# EAGLE design ChargePump (EAGLE 9.0.0)
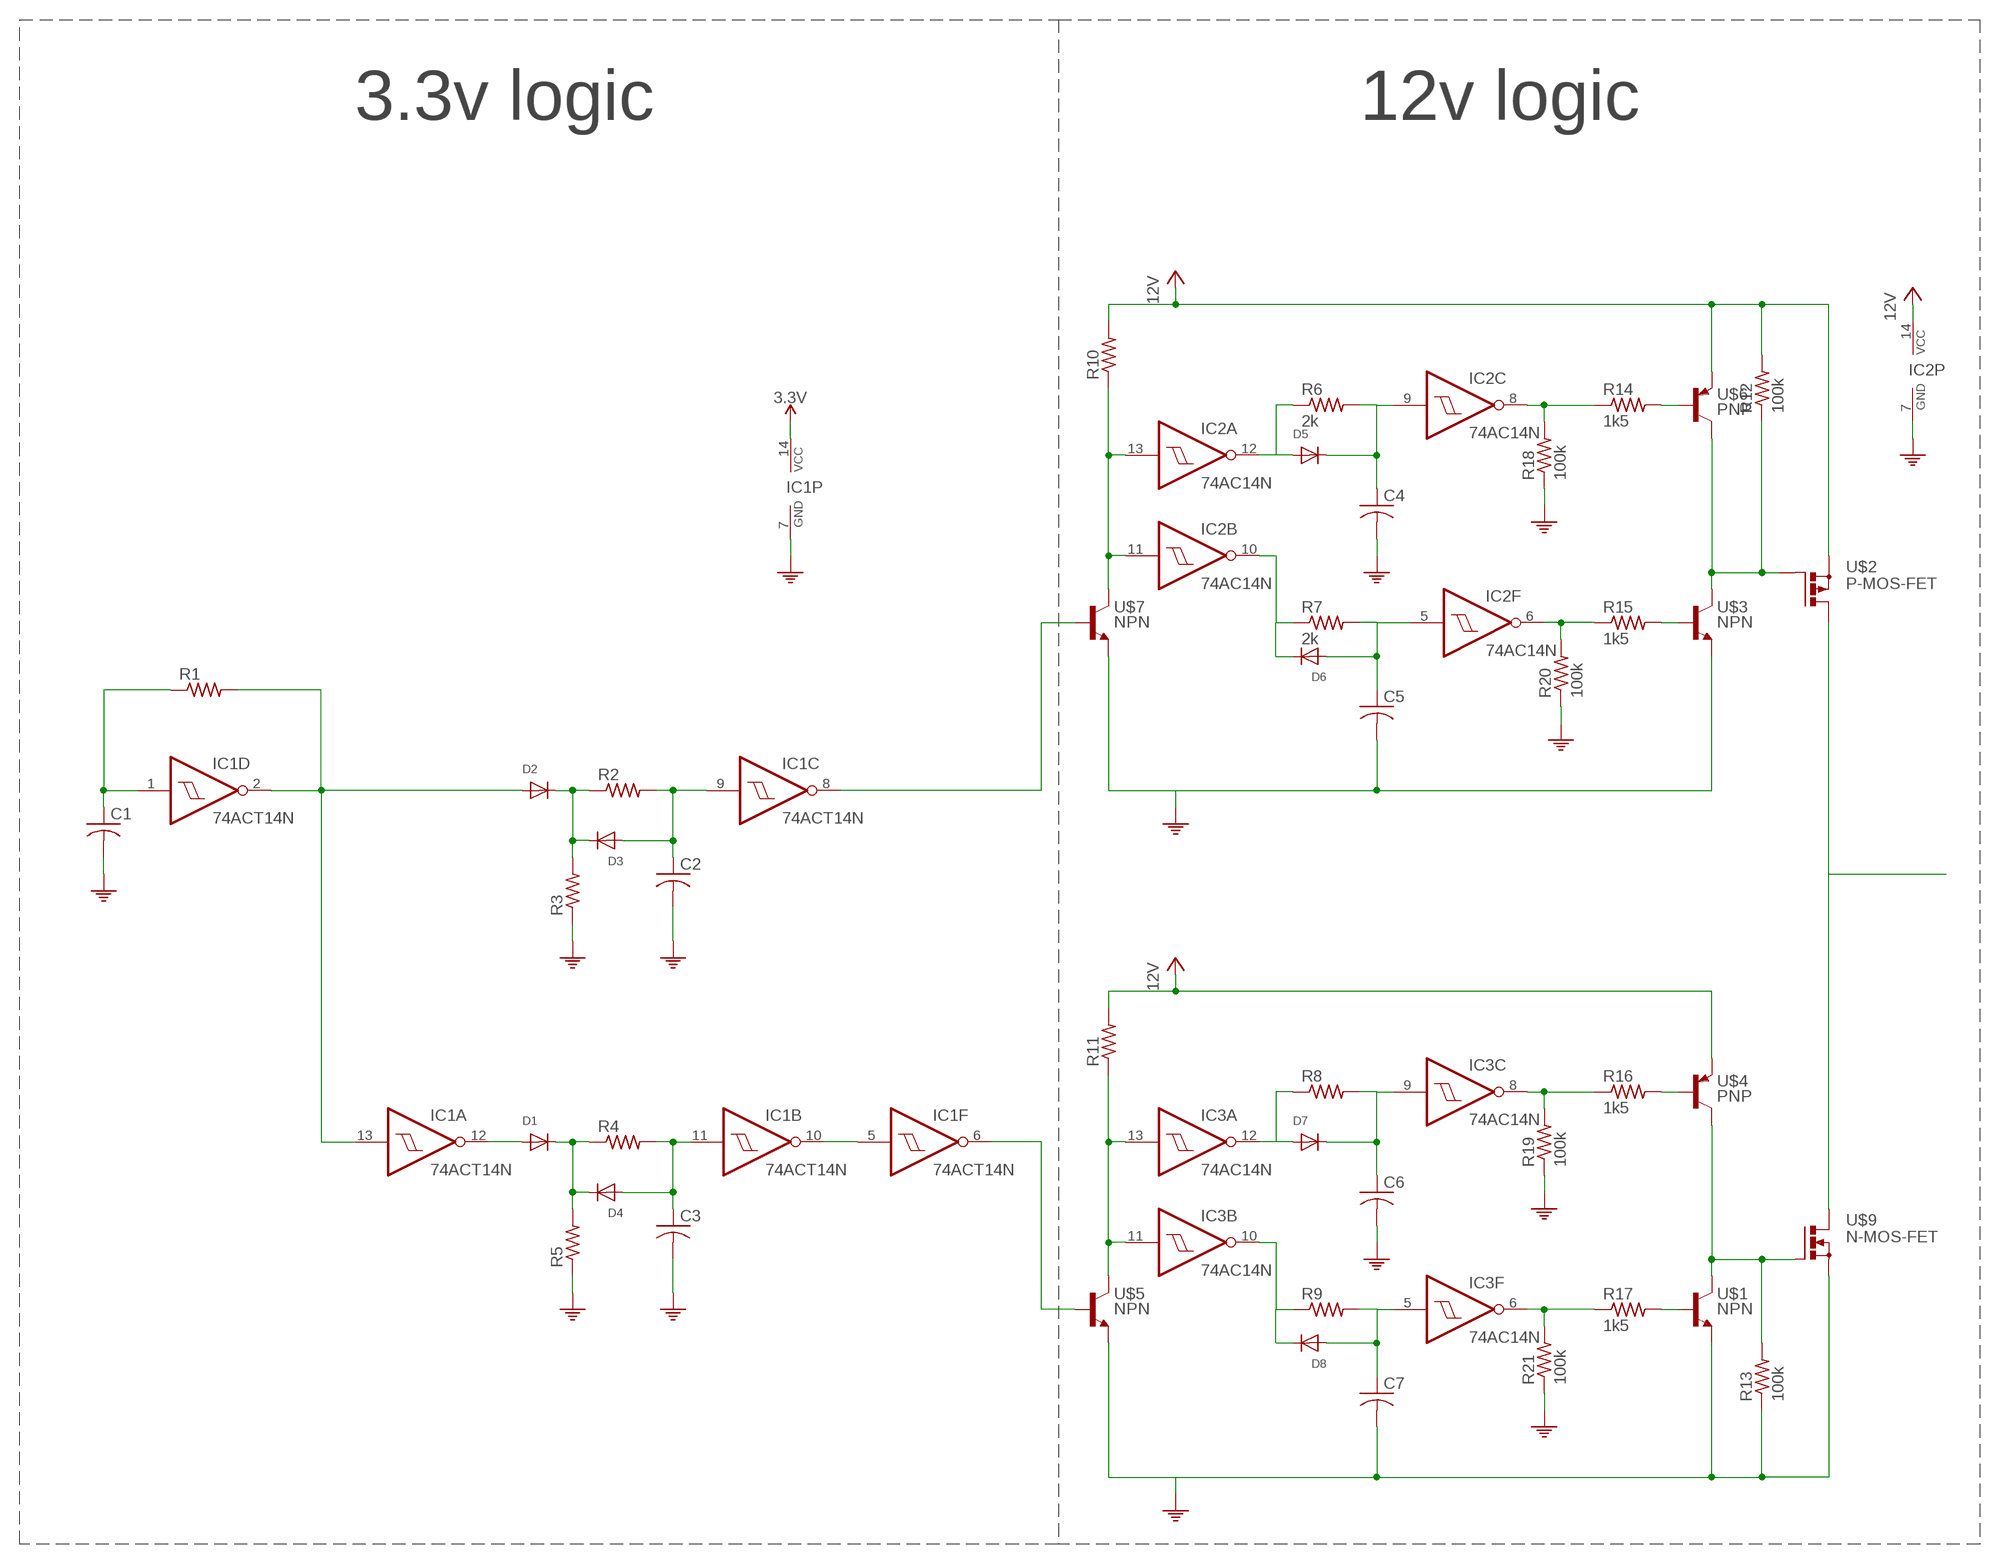
[diagram p0: schematic, sheet 1]

## Parts
C1  C-USC0603  [C0603]
C2  C-USC0603  [C0603]
C3  C-USC0603  [C0603]
C4  C-USC0603  [C0603]
C5  C-USC0603  [C0603]
C6  C-USC0603  [C0603]
C7  C-USC0603  [C0603]
D1  DIODEDO-1N4148  [DO-1N4148]
D2  DIODEDO-1N4148  [DO-1N4148]
D3  DIODEDO-1N4148  [DO-1N4148]
D4  DIODEDO-1N4148  [DO-1N4148]
D5  DIODEDO-1N4148  [DO-1N4148]
D6  DIODEDO-1N4148  [DO-1N4148]
D7  DIODEDO-1N4148  [DO-1N4148]
D8  DIODEDO-1N4148  [DO-1N4148]
IC1  74ACT14N  [DIL14]
IC2  74AC14N  [DIL14]
IC3  74AC14N  [DIL14]
R1  R-US_R0603  [R0603]
R2  R-US_R0603  [R0603]
R3  R-US_R0603  [R0603]
R4  R-US_R0603  [R0603]
R5  R-US_R0603  [R0603]
R6  2k  R-US_R0603  [R0603]
R7  2k  R-US_R0603  [R0603]
R8  R-US_R0603  [R0603]
R9  R-US_R0603  [R0603]
R10  R-US_R0603  [R0603]
R11  R-US_R0603  [R0603]
R12  100k  R-US_R0603  [R0603]
R13  100k  R-US_R0603  [R0603]
R14  1k5  R-US_R0603  [R0603]
R15  1k5  R-US_R0603  [R0603]
R16  1k5  R-US_R0603  [R0603]
R17  1k5  R-US_R0603  [R0603]
R18  100k  R-US_R0603  [R0603]
R19  100k  R-US_R0603  [R0603]
R20  100k  R-US_R0603  [R0603]
R21  100k  R-US_R0603  [R0603]
U$1  NPN  [SOT23]
U$2  P-MOS-FET  [SOT23]
U$3  NPN  [SOT23]
U$4  PNP  [SOT23]
U$5  NPN  [SOT23]
U$6  PNP  [SOT23]
U$7  NPN  [SOT23]
U$9  N-MOS-FET  [SOT23]

## Nets
3.3V: IC1.14(P:VCC)
+12V: IC2.14(P:VCC) R10.2 R11.2 R12.2 U$2.C(S) U$4.E U$6.E ; supply symbol labelled 12V
GND: C1.2 C2.2 C3.2 C4.2 C5.2 C6.2 C7.2 IC1.7(P:GND) IC2.7(P:GND) R3.1 R5.1 R13.1 R18.1 R19.1 R20.1 R21.1 U$1.E U$3.E U$5.E U$7.E U$9.E(S)
N$1: D2.A IC1.2(D:O) IC1.13(A:I) R1.2
N$2: C1.1 IC1.1(D:I) R1.1
N$3: D1.A IC1.12(A:O)
N$4: D2.C D3.C R2.1 R3.2
N$5: D1.C D4.C R4.1 R5.2
N$6: C2.1 D3.A IC1.9(C:I) R2.2
N$7: C3.1 D4.A IC1.11(B:I) R4.2
N$8: IC1.5(F:I) IC1.10(B:O)
N$10: R12.1 U$2.B(G) U$3.C U$6.C
N$11: R13.2 U$1.C U$4.C U$9.B(G)
N$12: IC1.8(C:O) U$7.B
N$13: D5.A IC2.12(A:O) R6.1
N$14: IC2.11(B:I) IC2.13(A:I) R10.1 U$7.C
N$15: D7.A IC3.12(A:O) R8.1
N$16: D6.C IC2.10(B:O) R7.1
N$17: C6.1 D7.C IC3.9(C:I) R8.2
N$18: C7.1 D8.A IC3.5(F:I) R9.2
N$19: C4.1 D5.C IC2.9(C:I) R6.2
N$20: C5.1 D6.A IC2.5(F:I) R7.2
N$21: IC2.8(C:O) R14.1 R18.2
N$22: R14.2 U$6.B
N$23: U$2.E(D) U$9.C(D)
N$24: IC2.6(F:O) R15.1 R20.2
N$25: R15.2 U$3.B
N$26: IC1.6(F:O) U$5.B
N$27: IC3.11(B:I) IC3.13(A:I) R11.1 U$5.C
N$28: D8.C IC3.10(B:O) R9.1
N$29: IC3.8(C:O) R16.1 R19.2
N$30: R16.2 U$4.B
N$31: IC3.6(F:O) R17.1 R21.2
N$32: R17.2 U$1.B
Unconnected: IC1.3(E:I) IC1.4(E:O) IC2.1(D:I) IC2.2(D:O) IC2.3(E:I) IC2.4(E:O) IC3.1(D:I) IC3.2(D:O) IC3.3(E:I) IC3.4(E:O)

## Notes on the sheet
- 3.3v logic | 12v logic

## Power pins joined to a net without a drawn wire
GND: IC3.7(P:GND)
VCC: IC3.14(P:VCC)

## Library data of the parts
C1-C7 = rcl:C-US: CAPACITOR, American symbol; SPICEPREFIX: C
D1-D8 = adafruit:DIODE: Diode SMADIODE - SMA Surface Mount Package 20V 1A Schottky Diode Digikey: 641-1014-6-ND DO-1N4148 - Through Hole Small Current Diode SOD-123 20V 1 A (.5mV Vf) Schottky Diode - Digikey: MBRX120TPMSCT-ND SOD-323 10V 570mA (.38mV Vf, 3ns) Schottky Diode - Digikey: ZLLS410CT-ND SOD-523 30V 30mA Schottky Diode (RB751S-40TE61) - Digikey: RB751S-40TE61CT-ND SOT23-R/W - SOT23 Package (R = Solder Paste/Reflow Ovens, W = Hand-Soldering) BAT54Film 40V 300mA - Digikey: 497-7162-1-ND
IC1-IC3 = 74xx-eu:74*14: Hex schmitt trigger INVERTER
R1-R21 = rcl:R-US_: RESISTOR, American symbol; SPICEPREFIX: R
U$1 U$3 U$5 U$7 = YabzLib:NPN
U$2 = YabzLib:P-MOS-FET
U$4 U$6 = YabzLib:PNP
U$9 = YabzLib:N-MOS-FET

## Board
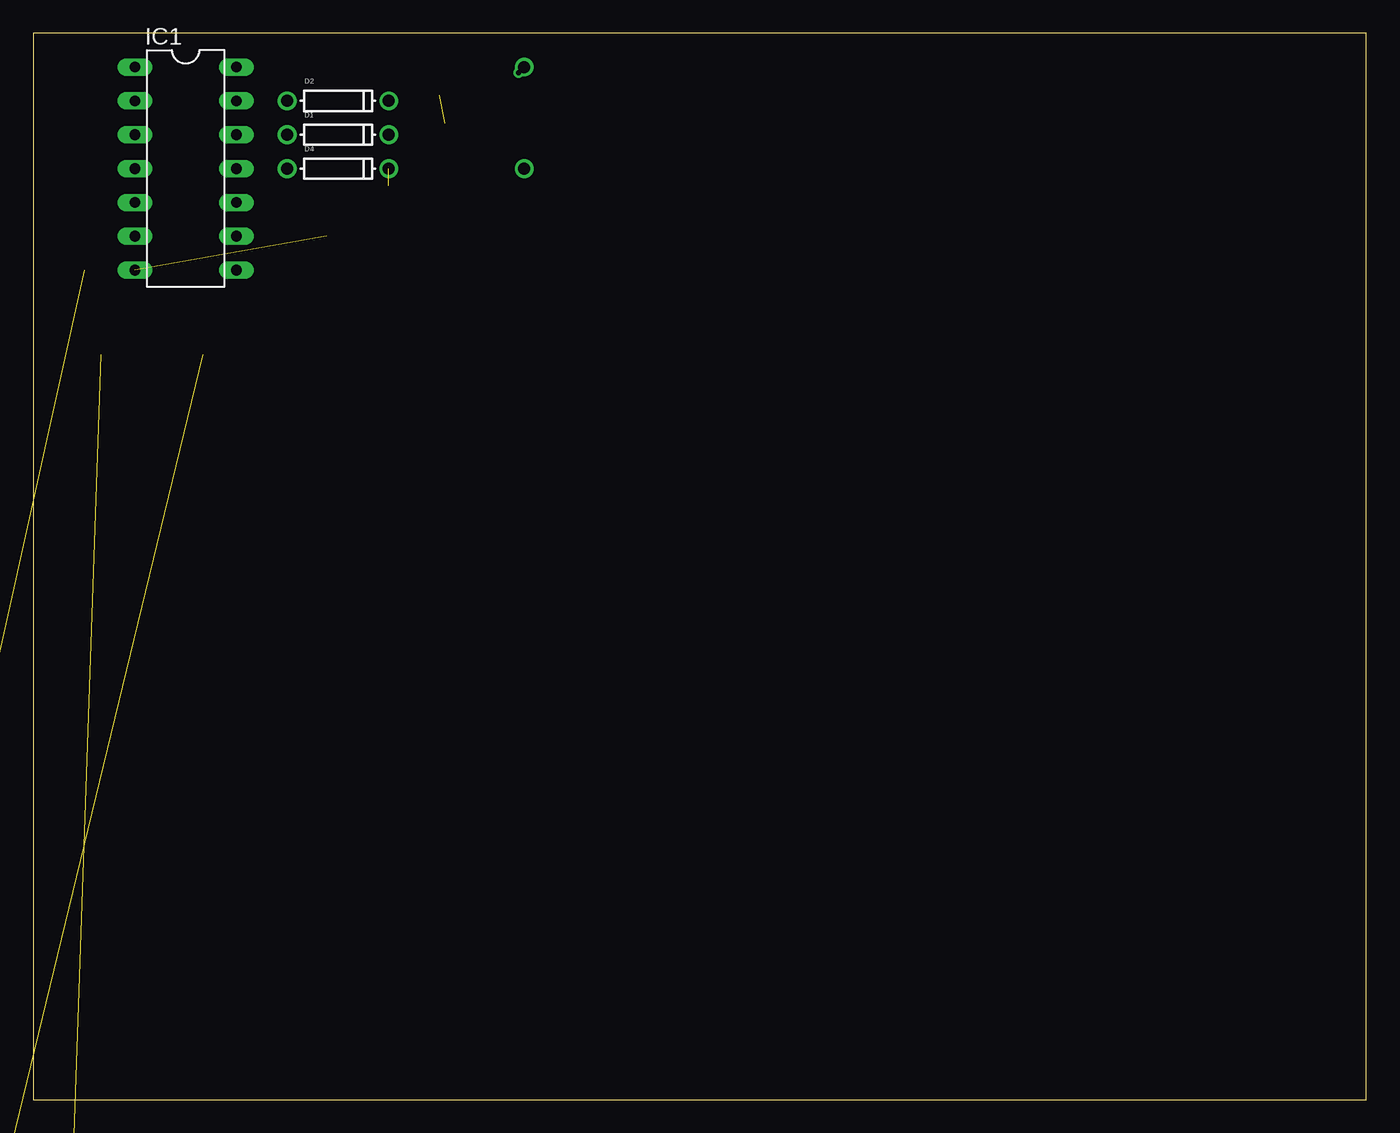
[diagram p1: board, top side]
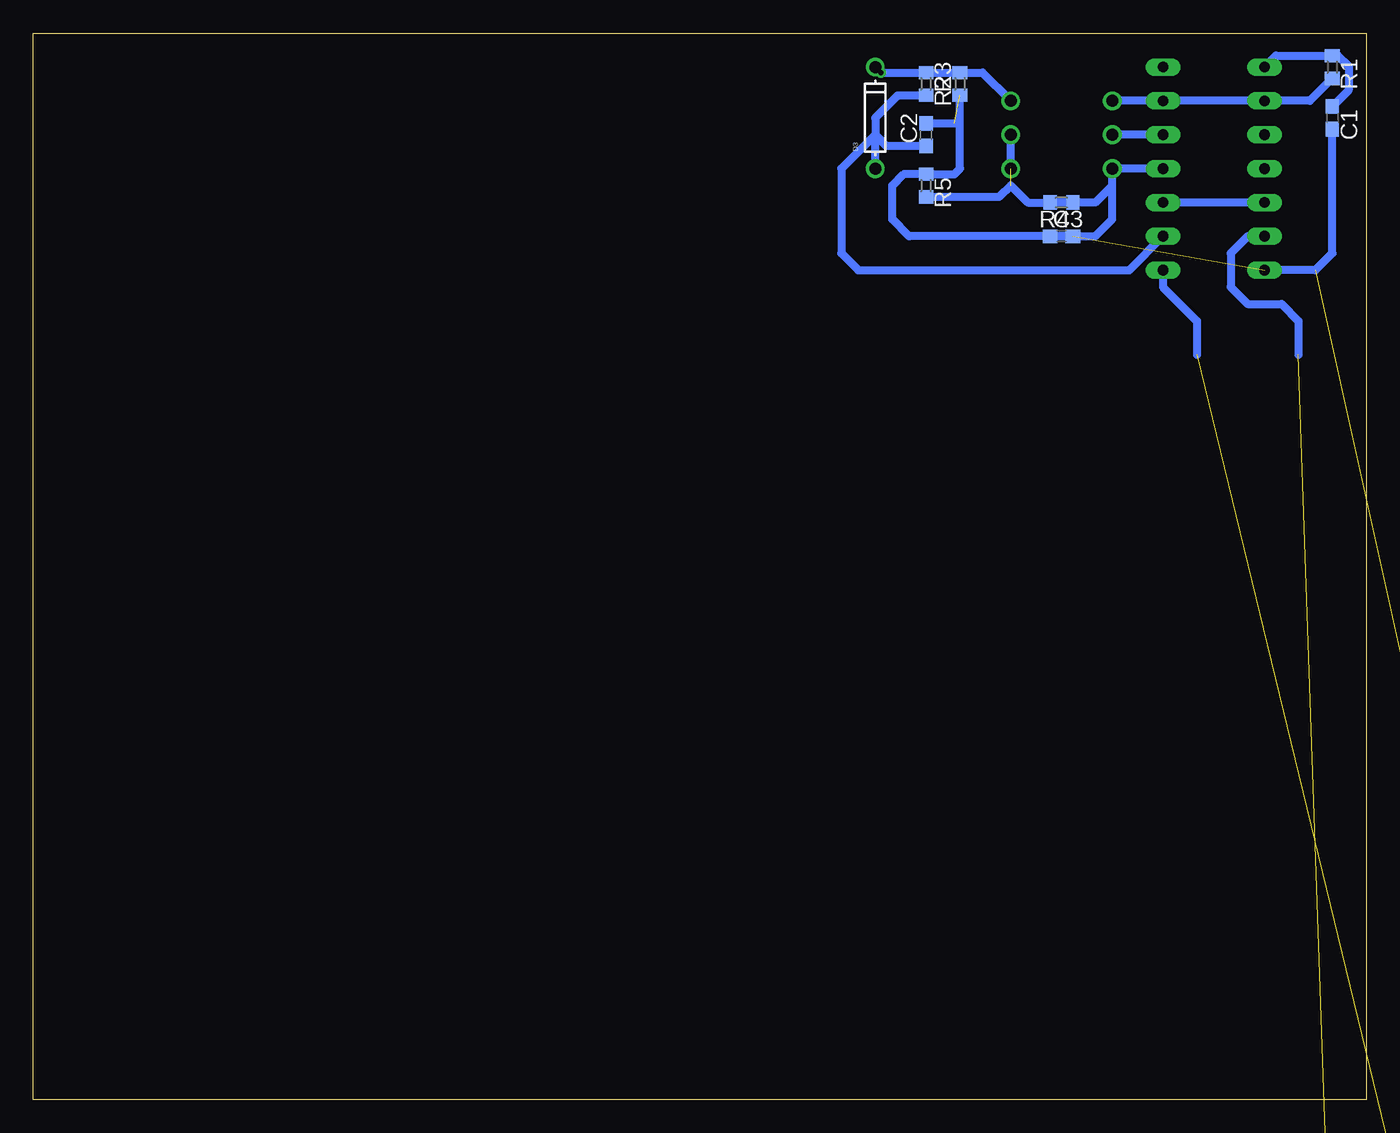
[diagram p2: board, bottom side, seen from below]

Size 100 x 80 mm. Coordinates in mm from the lower left corner, seen from the top.
Outline: 0,0 100,0 100,80 0,80 0,0
Copper layers (1*16): Top 0.035mm / dielectric 1.5mm / Bottom 0.035mm
Design rules "default": minimum track width 6mil, minimum drill 0.35mm, track to track 6mil, track to pad 6mil, pad to pad 6mil, via to via 6mil, smd to smd 6mil, copper to edge 40mil, drill to drill 6mil, minimum pad ring 10mil, minimum via ring 8mil, stop-mask expansion 4mil, vias tented up to drill 0mil, thermal gap 10mil

### Footprints (pad centres in the part's own frame; a part is rotated, then mirrored left to right if it is on the bottom)
C0603 = smd 1.1 x 1: 1 -0.85,0; 2 0.85,0
DO-1N4148 = drill 0.9: A -3.81,0; C 3.81,0
DIL14 = drill 0.813 long: 1 -7.62,-3.81; 2 -5.08,-3.81; 3 -2.54,-3.81; 4 0,-3.81; 5 2.54,-3.81; 6 5.08,-3.81; 7 7.62,-3.81; 8 7.62,3.81; 9 5.08,3.81; 10 2.54,3.81; 11 0,3.81; 12 -2.54,3.81; 13 -5.08,3.81; 14 -7.62,3.81
R0603 = smd 1 x 1.1: 1 -0.85,0; 2 0.85,0
SOT23 = smd 1 x 1.4: B -0.95,-1.1; C 0.95,-1.1; E 0,1.1

### Placement (x,y rotation side)
C1  2.54,73.66 270 bottom
C2  33.02,72.39 90 bottom
C3  22.86,64.77 0 bottom
C4  -34.29,-224.79 0 top  (outside the outline)
C5  -34.29,-228.6 0 top  (outside the outline)
C6  -6.35,-314.96 0 top  (outside the outline)
C7  0,-314.96 0 top  (outside the outline)
D1  22.86,72.39 0 top
D2  22.86,74.93 0 top
D3  36.83,73.66 90 bottom
D4  22.86,69.85 0 top
D5  -25.4,-199.39 0 top  (outside the outline)
D6  -25.4,-214.63 0 top  (outside the outline)
D7  -25.4,-289.56 0 top  (outside the outline)
D8  -25.4,-304.8 0 top  (outside the outline)
IC1  11.43,69.85 270 top
IC2  -22.86,-240.03 0 top  (outside the outline)
IC3  -22.86,-271.78 0 top  (outside the outline)
R1  2.54,77.47 270 bottom
R2  33.02,76.2 270 bottom
R3  30.48,76.2 90 bottom
R4  22.86,67.31 180 bottom
R5  33.02,68.58 270 bottom
R6  -35.56,-154.94 0 top  (outside the outline)
R7  -35.56,-160.02 0 top  (outside the outline)
R8  -15.24,-314.96 0 top  (outside the outline)
R9  -11.43,-314.96 0 top  (outside the outline)
R10  -35.56,-175.26 0 top  (outside the outline)
R11  -20.32,-314.96 0 top  (outside the outline)
R12  -35.56,-185.42 0 top  (outside the outline)
R13  -35.56,-327.66 0 top  (outside the outline)
R14  -35.56,-254 0 top  (outside the outline)
R15  -35.56,-259.08 0 top  (outside the outline)
R16  -30.48,-314.96 0 top  (outside the outline)
R17  -25.4,-314.96 0 top  (outside the outline)
R18  -35.56,-354.33 0 top  (outside the outline)
R19  -35.56,-359.41 0 top  (outside the outline)
R20  -35.56,-364.49 0 top  (outside the outline)
R21  -35.56,-369.57 0 top  (outside the outline)
U$1  -11.43,-300.99 0 top  (outside the outline)
U$2  -34.29,-102.87 0 top  (outside the outline)
U$3  -34.29,-110.49 0 top  (outside the outline)
U$4  -1.27,-300.99 0 top  (outside the outline)
U$5  -6.35,-300.99 0 top  (outside the outline)
U$6  -34.29,-133.35 0 top  (outside the outline)
U$7  -34.29,-140.97 0 top  (outside the outline)
U$9  -34.29,-321.31 0 top  (outside the outline)

### Tracks (layer width: path | path; a pad name or v marks a point on that pad's centre or on a via)
+12V  (6 unrouted)
GND  (18 unrouted)
  Bottom 0.61: C1.2 2.54,63.5 3.81,62.23 IC1.7 | C2.2 30.9,73.24 | C3.2 34.29,64.77 35.56,66.04 35.56,68.58 34.71,69.43 R5.1 30.9,69.43 30.48,69.85 R3.1
N$1
  Bottom 0.61: R1.2 4.23,74.93 IC1.2 IC1.13 D2.A
N$2
  Bottom 0.61: C1.1 1.32,75.73 1.32,77.52 2.12,78.32 R1.1 6.77,78.32 IC1.1
N$3
  Bottom 0.61: IC1.12 D1.A
N$4  (via drill 0.35)
  Bottom 0.61: D3.C v36.41,77.05 R2.1 R3.2 28.79,77.05 D2.C
N$5  (1 unrouted)
  Bottom 0.61: R4.1 25.4,67.31 26.67,68.58 27.52,67.73 R5.2 | D4.C D1.C
N$6
  Bottom 0.61: D3.A 36.83,72.39 | R2.2 35.14,75.35 36.83,73.66 36.83,72.39 | C2.1 35.98,71.54 36.83,72.39 | 36.83,72.39 39.37,69.85 39.37,63.5 38.1,62.23 17.78,62.23 IC1.9
N$7
  Bottom 0.61: R4.2 20.32,67.31 19.05,68.58 D4.A | C3.1 20.32,64.77 19.05,66.04 D4.A | IC1.11 D4.A
N$8
  Bottom 0.61: IC1.5 IC1.10
N$10  (3 unrouted)
N$11  (3 unrouted)
N$12  (1 unrouted)
  Bottom 0.61: IC1.8 15.24,60.96 12.7,58.42 12.7,55.88
N$13  (2 unrouted)
N$14  (3 unrouted)
N$15  (2 unrouted)
N$16  (2 unrouted)
N$17  (3 unrouted)
N$18  (3 unrouted)
N$19  (3 unrouted)
N$20  (3 unrouted)
N$21  (2 unrouted)
N$22  (1 unrouted)
N$23  (1 unrouted)
N$24  (2 unrouted)
N$25  (1 unrouted)
N$26  (1 unrouted)
  Bottom 0.61: IC1.6 8.89,64.77 10.16,63.5 10.16,60.96 8.89,59.69 6.35,59.69 5.08,58.42 5.08,55.88
N$27  (3 unrouted)
N$28  (2 unrouted)
N$29  (2 unrouted)
N$30  (1 unrouted)
N$31  (2 unrouted)
N$32  (1 unrouted)